# EAGLE design untitled (EAGLE 7.2.0)
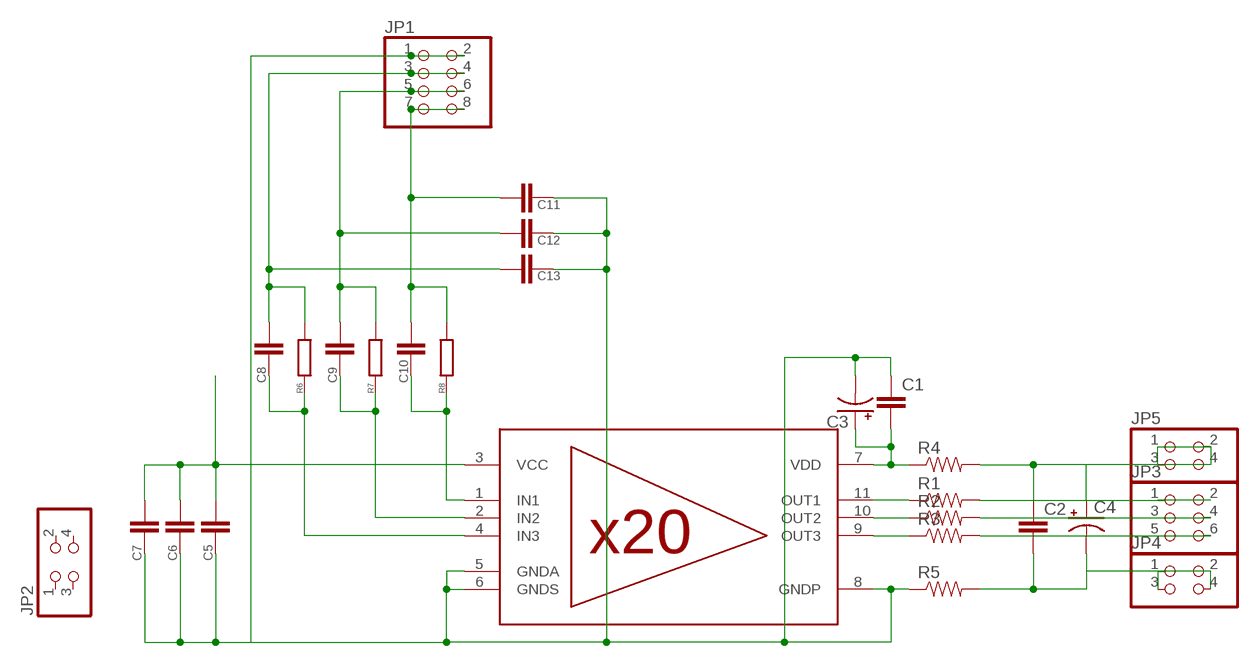
[diagram p0: schematic, sheet 1]

## Parts
C1  CAPPTH1  [CAP-PTH-5MM]
C2  CAPPTH1  [CAP-PTH-5MM]
C3  CPOL-USE5-8.5  [E5-8,5]
C4  CPOL-USE5-8.5  [E5-8,5]
C5  CC0805  [C0805]
C6  CC0805  [C0805]
C7  CC0805  [C0805]
C8  CC0805  [C0805]
C9  CC0805  [C0805]
C10  CC0805  [C0805]
C11  CC0805  [C0805]
C12  CC0805  [C0805]
C13  CC0805  [C0805]
JP1  PINHD-2X04_2.54-SMD  [2X04SMD]
JP2  PINHD-2X02_2.54-SMD  [2X02SMD]
JP3  PINHD-2X03_2.54-SMD  [2X03SMD]
JP4  PINHD-2X02_2.54-SMD  [2X02SMD]
JP5  PINHD-2X02_2.54-SMD  [2X02SMD]
R1  RESISTORPTH-1/2W  [AXIAL-0.5]
R2  RESISTORPTH-1/2W  [AXIAL-0.5]
R3  RESISTORPTH-1/2W  [AXIAL-0.5]
R4  RESISTORPTH-1/2W  [AXIAL-0.5]
R5  RESISTORPTH-1/2W  [AXIAL-0.5]
R6  R0805  [R0805]
R7  R0805  [R0805]
R8  R0805  [R0805]
U$1  STV9556  [TA11B]

## Nets
N$1: R1.P$1 U$1.11(OUT1)
N$2: R2.P$1 U$1.10(OUT2)
N$3: R3.P$1 U$1.9(OUT3)
N$4: C1.1 C3.- C5.2 C6.2 C7.2 C11.2 C12.2 C13.2 JP1.1 JP1.2 R5.P$1 U$1.5(GNDA) U$1.6(GNDS) U$1.8(GNDP)
N$5: C1.2 C3.+ R4.P$1 U$1.7(VDD)
N$6: C5.1 C6.1 C7.1 U$1.3(VCC)
N$7: JP3.1 JP3.2 R1.P$2
N$10: JP3.3 JP3.4 R2.P$2
N$11: C10.2 R8.1 U$1.1(IN1)
N$12: C9.2 R7.1 U$1.2(IN2)
N$13: C8.2 R6.1 U$1.4(IN3)
N$14: JP3.5 JP3.6 R3.P$2
N$15: C2.2 C4.- JP4.1 JP4.2 JP4.3 JP4.4 R5.P$2
N$17: C8.1 C13.1 JP1.3 JP1.4 R6.2
N$18: C9.1 C12.1 JP1.5 JP1.6 R7.2
N$19: C10.1 C11.1 JP1.7 JP1.8 R8.2
N$20: C2.1 C4.+ JP5.1 JP5.2 JP5.3 JP5.4 R4.P$2
Unconnected: JP2.1 JP2.2 JP2.3 JP2.4

## Library data of the parts
C1 C2 = SparkFun-Capacitors:CAP: Capacitor Standard 0603 ceramic capacitor, and 0.1" leaded capacitor.
C3 C4 = rcl:CPOL-US: POLARIZED CAPACITOR, American symbol
C5-C13 = smalsmd:C: Capacitor
JP1 = pinhead-2:PINHD-2X04: PIN HEADER
JP2 JP4 JP5 = pinhead-2:PINHD-2X02: PIN HEADER
JP3 = pinhead-2:PINHD-2X03: PIN HEADER
R1-R5 = SparkFun-Passives:RESISTOR: Resistor Basic schematic elements and footprints for 0603, 1206, and PTH resistors.
R6-R8 = smalsmd:R
U$1 = OU:STV9556

## Board
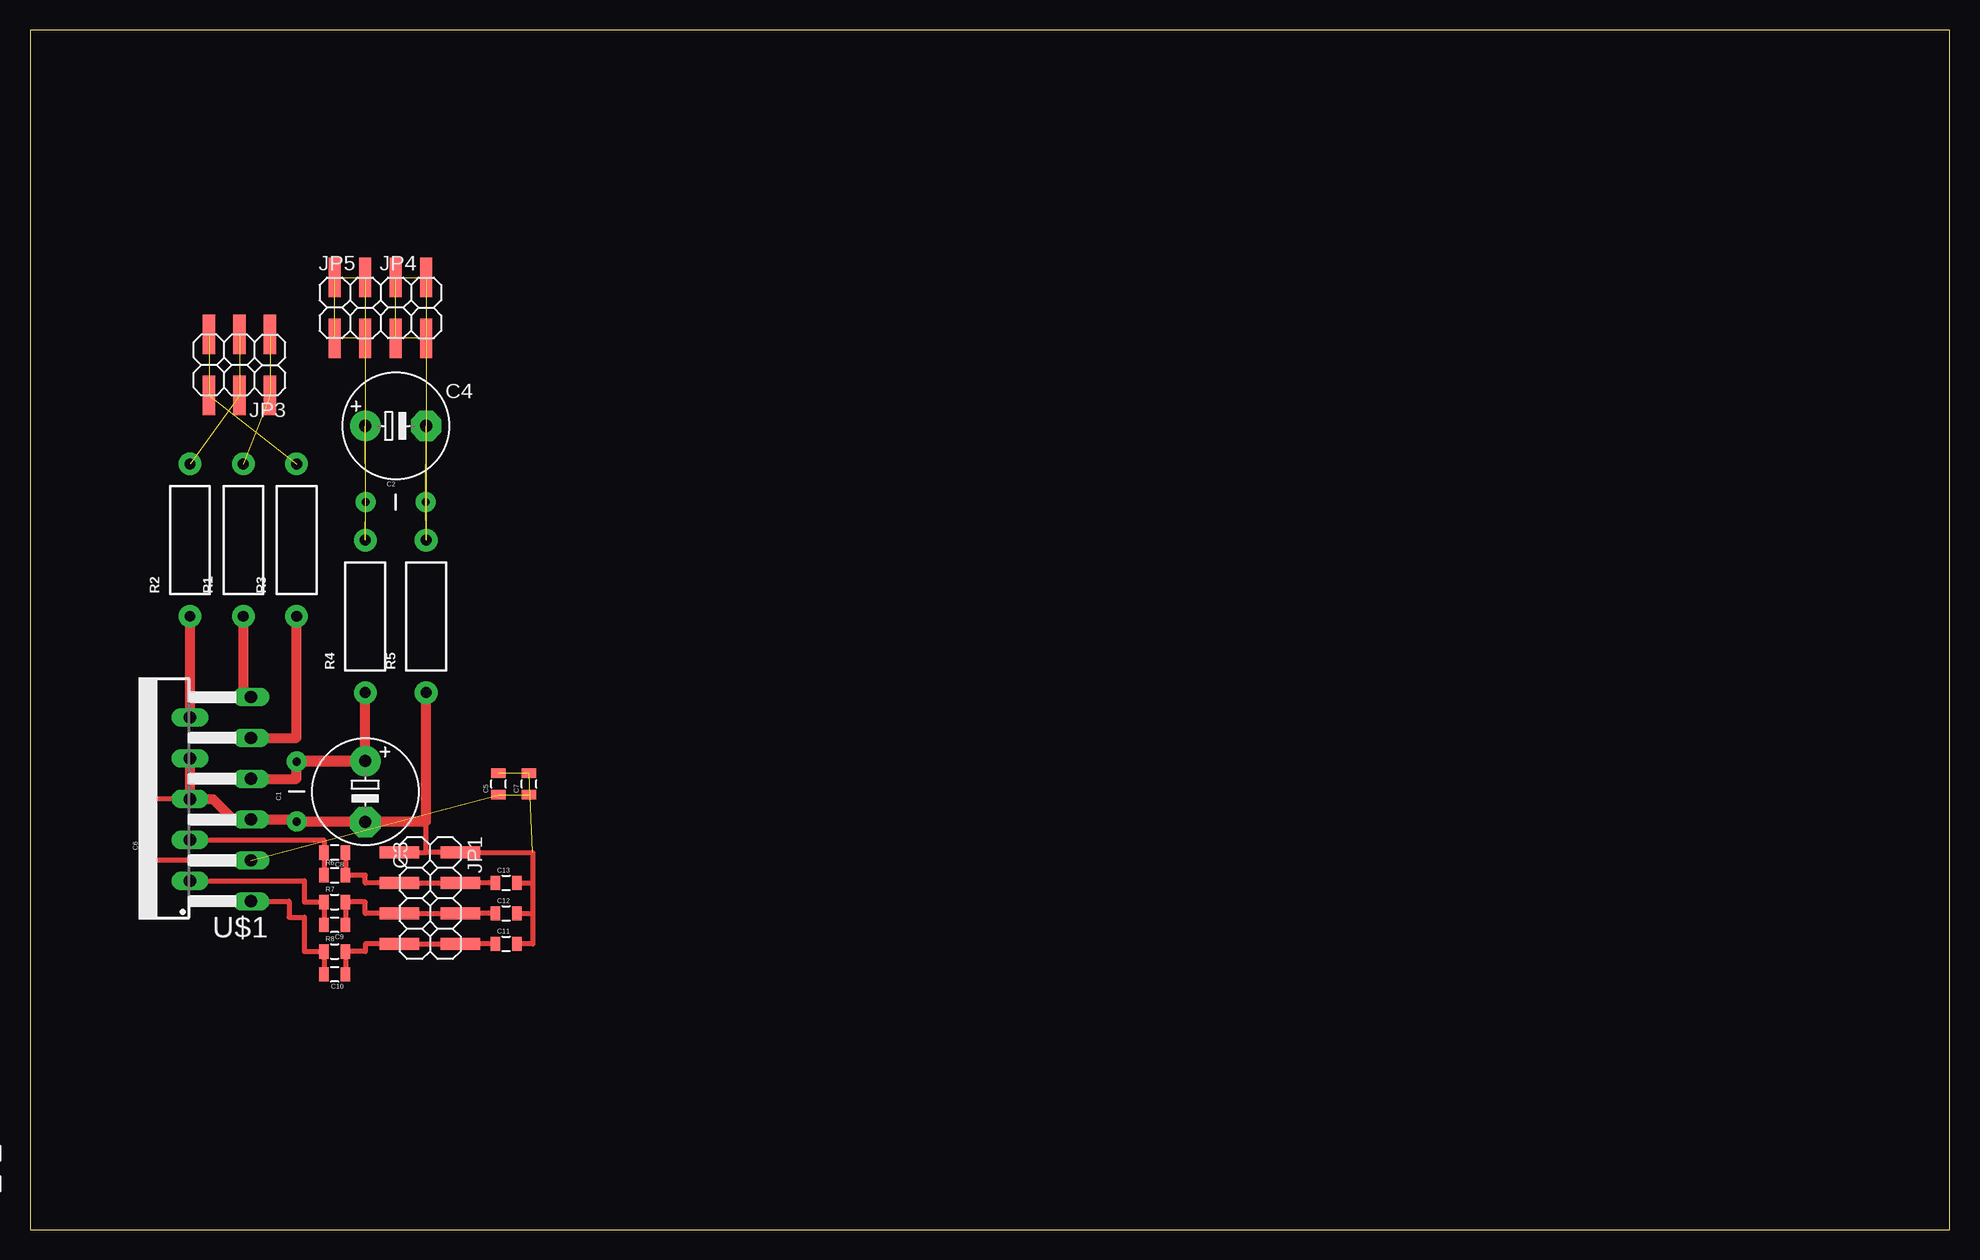
[diagram p1: board, top side]

Size 160 x 100 mm. Coordinates in mm from the lower left corner, seen from the top.
Outline: 0,0 160,0 160,100 0,100 0,0
Copper layers (1*16): Top 0.035mm / dielectric 1.5mm / Bottom 0.035mm
Design rules "default": minimum track width 0.2mm, minimum drill 0.2mm, track to track 0.2mm, track to pad 0.2mm, pad to pad 0.2mm, via to via 0.2mm, smd to smd 0.2mm, copper to edge 0.2mm, drill to drill 0.2mm, minimum pad ring 10mil, minimum via ring 8mil, stop-mask expansion 4mil, vias tented up to drill 0mil, thermal gap 10mil

### Footprints (pad centres in the part's own frame; a part is rotated, then mirrored left to right if it is on the bottom)
CAP-PTH-5MM = drill 0.7 pad 1.651: 1 -2.5,0; 2 2.5,0
E5-8,5 = drill 1.016 pad 2.54: + -2.54,0 | drill 1.016 pad 2.54 octagon: - 2.54,0
C0805 = smd 0.8 x 1.2: 1 -0.9,0; 2 0.9,0
2X04SMD = smd 1.016 x 3.302: 1 -1.27,-3.81; 2 -1.27,1.27; 3 1.27,-3.81; 4 1.27,1.27; 5 3.81,-3.81; 6 3.81,1.27; 7 6.35,-3.81; 8 6.35,1.27
2X02SMD = smd 1.016 x 3.302: 1 -1.27,-3.81; 2 -1.27,1.27; 3 1.27,-3.81; 4 1.27,1.27
2X03SMD = smd 1.016 x 3.302: 1 -1.27,-3.81; 2 -1.27,1.27; 3 1.27,-3.81; 4 1.27,1.27; 5 3.81,-3.81; 6 3.81,1.27
AXIAL-0.5 = drill 0.9 pad 1.88: P$1 -6.35,0; P$2 6.35,0
R0805 = smd 0.8 x 1.2: 1 -0.9,0; 2 0.9,0
TA11B = drill 1.016 long: 1 -8.509,-7.62; 2 -6.807,-2.54; 3 -5.105,-7.62; 4 -3.404,-2.54; 5 -1.702,-7.62; 6 0,-2.54; 7 1.702,-7.62; 8 3.404,-2.54; 9 5.105,-7.62; 10 6.807,-2.54; 11 8.509,-7.62

### Placement (x,y rotation side)
C1  22.23,36.51 90 top
C2  30.48,60.64 0 top
C3  27.94,36.51 270 top
C4  30.48,66.99 0 top
C5  39.05,37.15 90 top
C6  9.84,32.38 90 top
C7  41.59,37.15 90 top
C8  25.4,31.43 180 top
C9  25.4,25.4 180 top
C10  25.4,21.27 180 top
C11  39.69,23.81 0 top
C12  39.69,26.35 0 top
C13  39.69,28.89 0 top
JP1  34.61,30.16 270 top
JP2  -5.08,6.35 0 top  (outside the outline)
JP3  18.73,70.8 180 top
JP4  31.75,78.11 0 top
JP5  26.67,78.11 0 top
R1  17.78,57.47 90 top
R2  13.34,57.47 90 top
R3  22.23,57.47 90 top
R4  27.94,51.12 90 top
R5  33.02,51.12 90 top
R6  25.4,29.53 0 top
R7  25.4,27.3 0 top
R8  25.4,23.18 0 top
U$1  10.79,35.88 90 top

### Tracks (layer width: path | path; a pad name or v marks a point on that pad's centre or on a via)
N$1
  Top 0.813: R1.P$1 17.78,44.39 U$1.11
N$2
  Top 0.813: U$1.10 R2.P$1
N$3
  Top 0.813: U$1.9 22.23,40.98 R3.P$1
N$4  (2 unrouted)
  Top 0.406: U$1.6 9.84,35.88 C6.2 | JP1.1 33.02,31.43 | 33.02,31.43 33.02,34.01 | 33.02,31.43 JP1.2 41.91,31.43 41.91,28.89 | 41.91,28.89 41.91,26.35 | 41.91,26.35 41.91,23.81 C11.2 | C12.2 41.91,26.35 | C13.2 41.91,28.89
  Top 0.813: C1.1 22.54,34.18 U$1.5 16.94,34.18 15.24,35.88 U$1.6 U$1.8 | C1.1 33.02,34.01 R5.P$1 | C3.- 22.23,33.97 C1.1
N$5
  Top 0.813: U$1.7 22.23,37.58 C1.2 | C1.2 27.94,39.01 R4.P$1 | C3.+ 22.23,39.05 C1.2
N$6  (2 unrouted)
  Top 0.406: U$1.3 9.84,30.77 C6.1
N$7  (2 unrouted)
N$10  (2 unrouted)
N$11
  Top 0.406: U$1.1 21.59,27.37 21.59,26.04 22.86,26.04 22.86,23.18 R8.1 C10.2
N$12
  Top 0.406: U$1.2 22.86,29.07 22.86,27.3 R7.1 C9.2
N$13
  Top 0.406: U$1.4 24.5,32.47 C8.2 R6.1
N$14  (2 unrouted)
N$15  (6 unrouted)
N$17
  Top 0.406: C8.1 R6.2 27.94,29.53 27.94,28.89 JP1.3 JP1.4 C13.1
N$18
  Top 0.406: C9.1 R7.2 27.94,27.3 27.94,26.35 JP1.5 JP1.6 C12.1
N$19
  Top 0.406: C10.1 R8.2 27.94,23.18 27.94,23.81 JP1.7 JP1.8 C11.1
N$20  (6 unrouted)